# EasyEDA schematic blot-control-board.easyEDA-schematic.json
TITLE: Sheet_1; REV: 1.0; Date: 2024-05-08; Sheet: 1/1; Drawn By: bettermakestuff; Company: Your Company
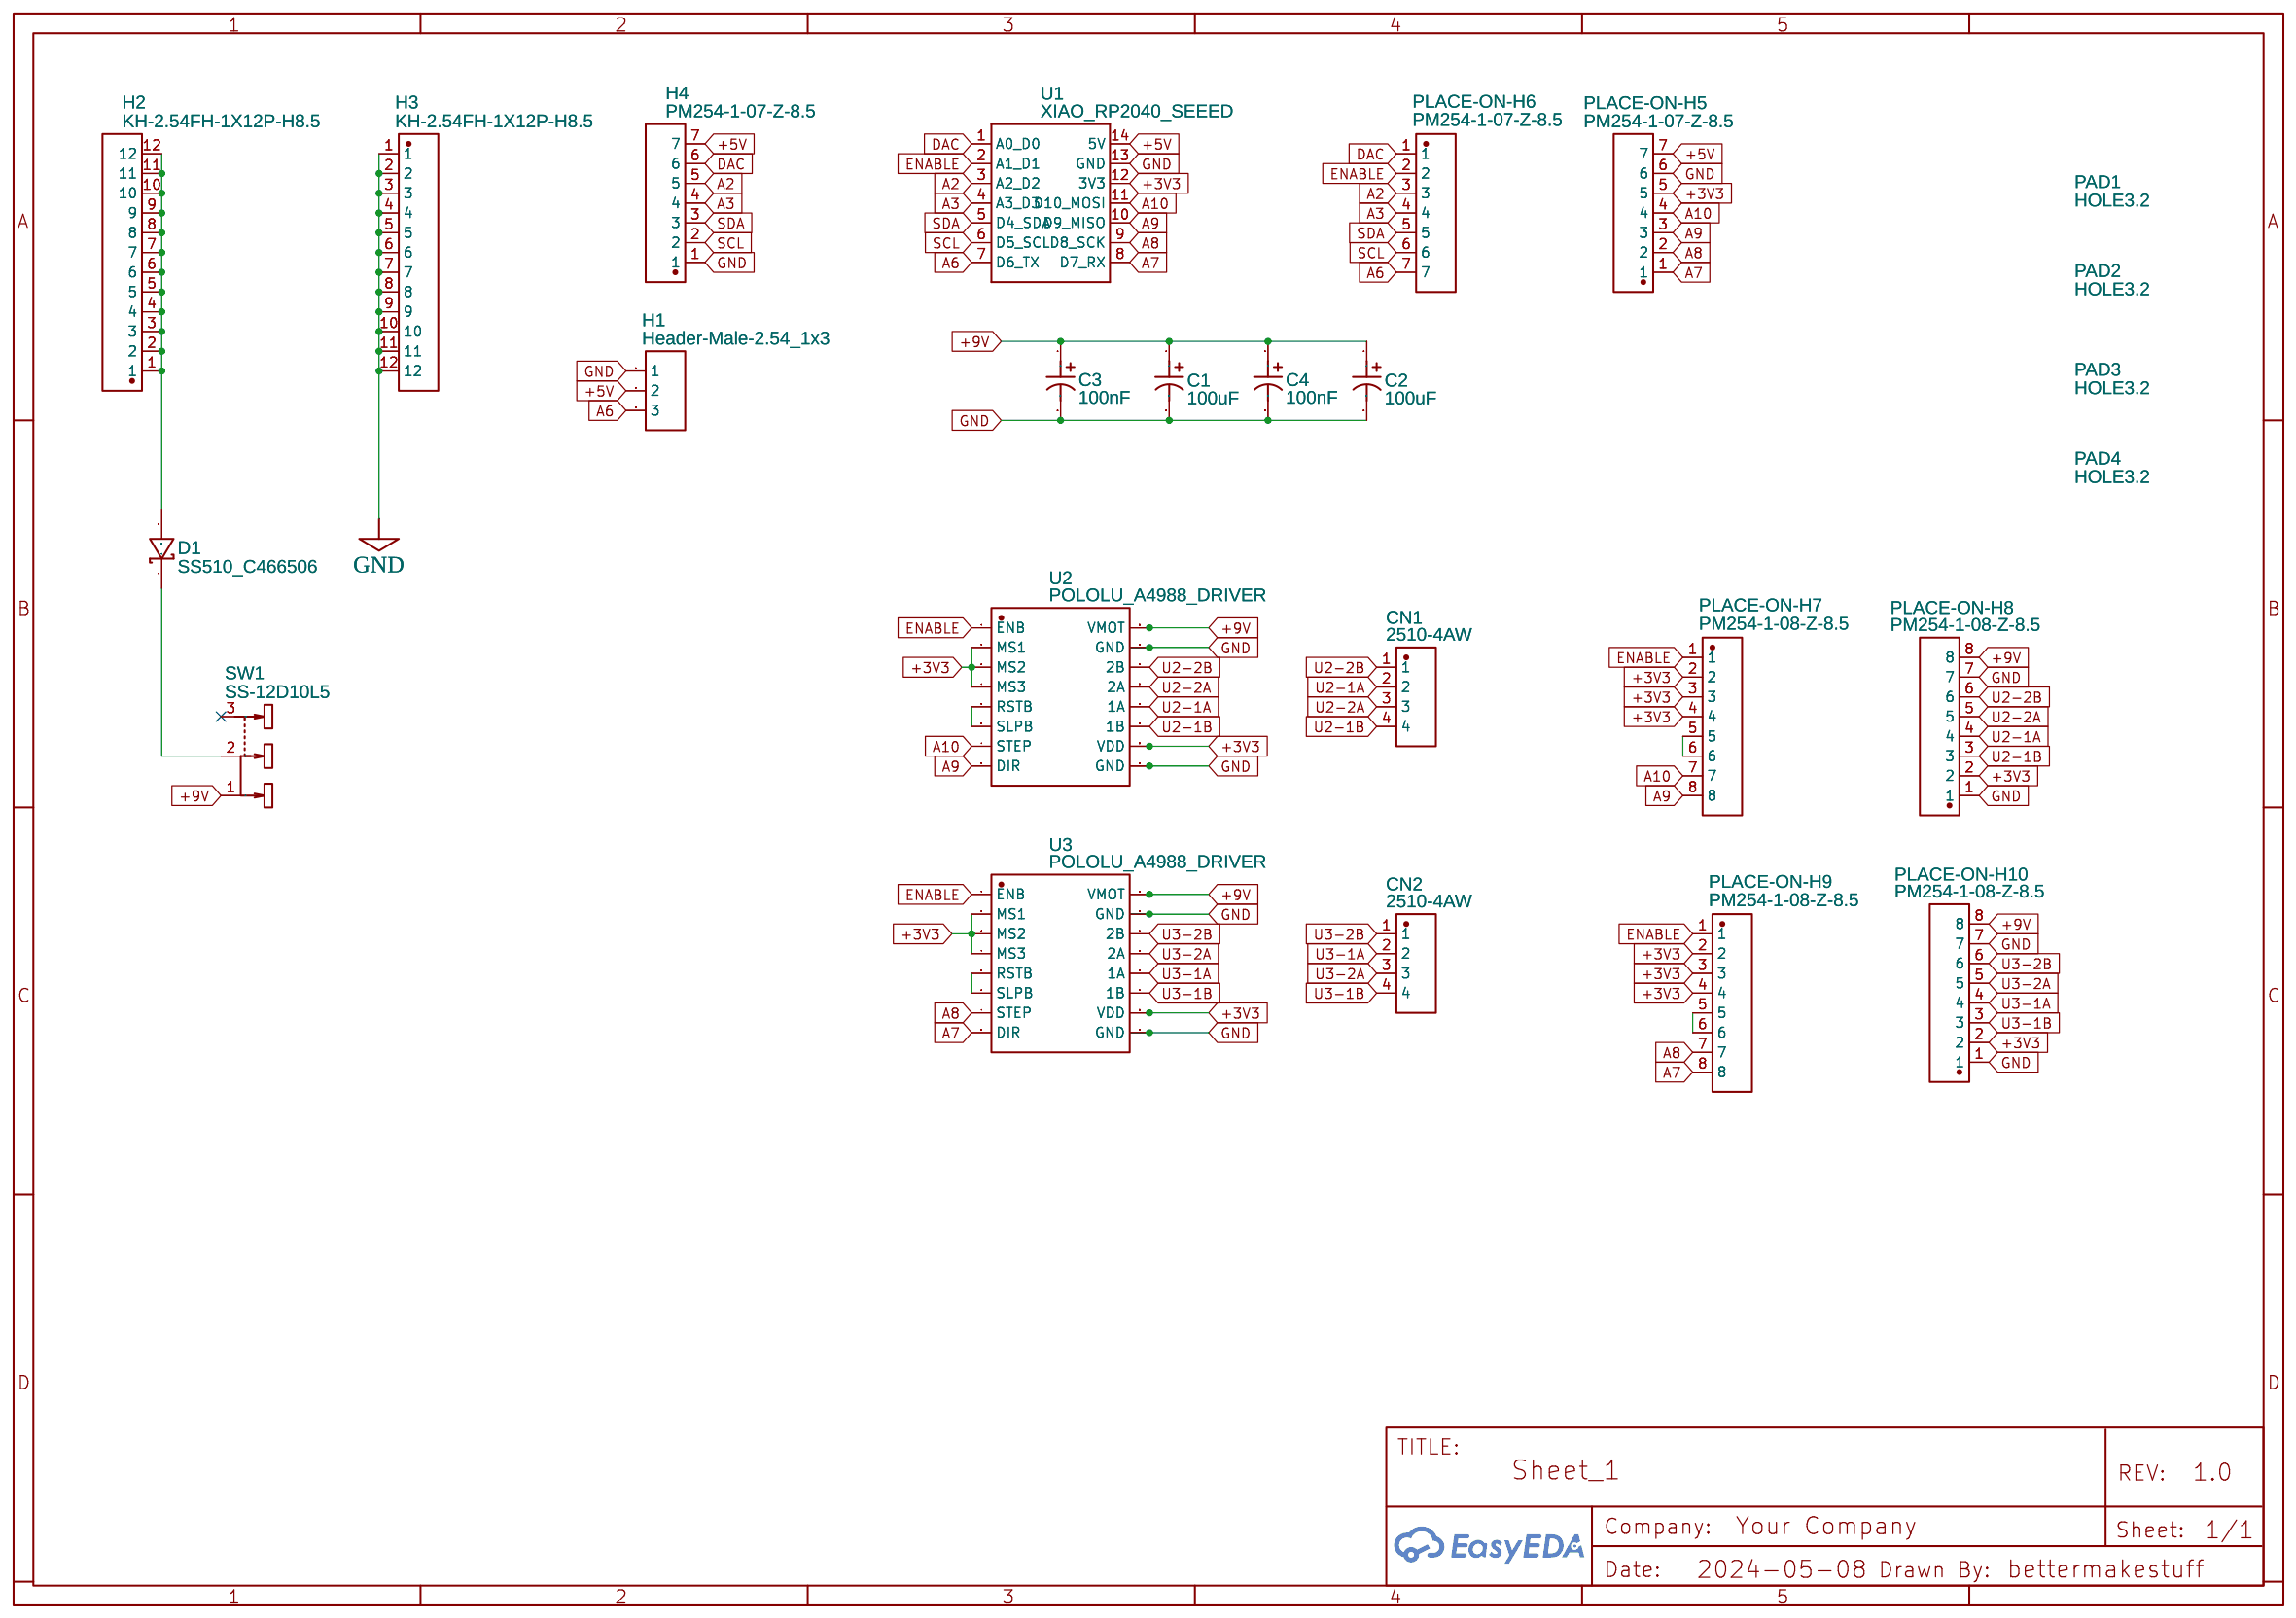
[diagram p0: schematic sheet]

## Parts
C1  100uF  [CAP-SMD_BD6.3-L6.6-W6.6-LS7.3-FD]
C2  100uF  [CAP-SMD_BD6.3-L6.6-W6.6-LS7.3-FD]
C3  100nF  [CAP-SMD_L3.2-W1.6-RD]
C4  100nF  [CAP-SMD_L3.2-W1.6-RD]
CN1  2510-4AW  [CONN-TH_2510-4AW]
CN2  2510-4AW  [CONN-TH_2510-4AW]
D1  SS510_C466506  [SMA_L4.2-W2.6-LS5.3-RD]
H1  Header-Male-2.54_1x3  [HDR-TH_3P-P2.54-V-M-1]
H2  KH-2.54FH-1X12P-H8.5  [HDR-TH_12P-P2.54-V-F]
H3  KH-2.54FH-1X12P-H8.5  [HDR-TH_12P-P2.54-V-F]
H4  PM254-1-07-Z-8.5  [HDR-TH_7P-P2.54-V-F]
PAD1  HOLE3.2  [HOLE-3.2MM]
PAD2  HOLE3.2  [HOLE-3.2MM]
PAD3  HOLE3.2  [HOLE-3.2MM]
PAD4  HOLE3.2  [HOLE-3.2MM]
PLACE-ON-H5  PM254-1-07-Z-8.5  [HDR-TH_7P-P2.54-V-F]
PLACE-ON-H6  PM254-1-07-Z-8.5  [HDR-TH_7P-P2.54-V-F]
PLACE-ON-H7  PM254-1-08-Z-8.5  [HDR-TH_8P-P2.54-V-F]
PLACE-ON-H8  PM254-1-08-Z-8.5  [HDR-TH_8P-P2.54-V-F]
PLACE-ON-H9  PM254-1-08-Z-8.5  [HDR-TH_8P-P2.54-V-F]
PLACE-ON-H10  PM254-1-08-Z-8.5  [HDR-TH_8P-P2.54-V-F]
SW1  SS-12D10L5  [SW-TH_SS-12D10L5]
U1  XIAO_RP2040_SEEED  [XIAO_RP2040_SEEED]
U2  POLOLU_A4988_DRIVER  [POLOLU_A4988]
U3  POLOLU_A4988_DRIVER  [POLOLU_A4988]

## Library data of the parts
C1 C2 = RST100UF25V004: Supplier: LCSC; Supplier Part: C4747964; Manufacturer: KNSCHA(科尼盛); JLCPCB Part Class: Extended Part; Contributor: lcsc
C3 C4 = CA45-A-35V-0.1UF-K: Contributor: LCSC; Supplier: LCSC; Supplier Part: C2976900; Manufacturer: CEC(振华新云); JLCPCB Part Class: Extended Part
CN1 CN2 = 2510-4AW: Contributor: LCSC; Supplier: LCSC; Supplier Part: C722720; Manufacturer: CAX(创都); JLCPCB Part Class: Extended Part
D1 = SS510_C466506: Contributor: LCSC; Supplier: LCSC; Supplier Part: C466506; Manufacturer: High Diode(海德); Manufacturer Part: SS510; JLCPCB Part Class: Extended Part
H1 = Header-Male-2.54_1x3: Supplier: LCSC; Manufacturer: BOOMELE(博穆精密); Manufacturer Part: 2.54-1*3P针; Supplier Part: C49257; JLCPCB Part Class: Extended Part
H2 H3 = KH-2.54FH-1X12P-H8.5: Contributor: LCSC; Supplier: LCSC; Supplier Part: C2905419; Manufacturer: kinghelm(金航标); JLCPCB Part Class: Extended Part
H4 PLACE-ON-H5 PLACE-ON-H6 = PM254-1-07-Z-8.5: Contributor: LCSC; Supplier: LCSC; Supplier Part: C2897370; Manufacturer: HCTL(华灿天禄); JLCPCB Part Class: Extended Part
PAD1-PAD4 = HOLE3.2: Contributor: M.khalilsaeid
PLACE-ON-H7 PLACE-ON-H9 PLACE-ON-H10 = PM254-1-08-Z-8.5: Contributor: LCSC; Supplier: LCSC; Supplier Part: C2897371; Manufacturer: HCTL(华灿天禄); JLCPCB Part Class: Extended Part
PLACE-ON-H8 = PM254-1-08-Z-8.5: Contributor: LCSC; Supplier: LCSC; Supplier Part: C2897371; Manufacturer: HCTL(华灿天禄); JLCPCB Part Class: Extended Part; Package Display: No
SW1 = SS-12D10L5: Contributor: LCSC; Supplier: LCSC; Supplier Part: C319012; Manufacturer: XKB Connectivity(中国星坤); JLCPCB Part Class: Extended Part
U1 = XIAO_RP2040_SEEED: Contributor: jeen
U2 U3 = POLOLU_A4988_DRIVER: link: https://www.pololu.com/product/1182; Contributor: rom_yaz

## Nets
+3V3: PLACE-ON-H5.5 PLACE-ON-H7.2 PLACE-ON-H7.3 PLACE-ON-H7.4 PLACE-ON-H8.2 PLACE-ON-H9.2 PLACE-ON-H9.3 PLACE-ON-H9.4 PLACE-ON-H10.2 U1.12(3V3) U2.2(MS1) U2.3(MS2) U2.4(MS3) U2.10(VDD) U3.2(MS1) U3.3(MS2) U3.4(MS3) U3.10(VDD)
+5V: H1.2 H4.7 PLACE-ON-H5.7 U1.14(5V)
+9V: C1.1 C2.1 C3.1 C4.1 PLACE-ON-H8.8 PLACE-ON-H10.8 SW1.1 U2.16(VMOT) U3.16(VMOT)
GND: C1.2 C2.2 C3.2 C4.2 H1.1 H3.1 H3.2 H3.3 H3.4 H3.5 H3.6 H3.7 H3.8 H3.9 H3.10 H3.11 H3.12 H4.1 PLACE-ON-H5.6 PLACE-ON-H8.1 PLACE-ON-H8.7 PLACE-ON-H10.1 PLACE-ON-H10.7 U1.13(GND) U2.9(GND) U2.15(GND) U3.9(GND) U3.15(GND)
A2: H4.5 PLACE-ON-H6.3 U1.3(A2_D2)
A3: H4.4 PLACE-ON-H6.4 U1.4(A3_D3)
A6: H1.3 PLACE-ON-H6.7 U1.7(D6_TX)
A7: PLACE-ON-H5.1 PLACE-ON-H9.8 U1.8(D7_RX) U3.8(DIR)
A8: PLACE-ON-H5.2 PLACE-ON-H9.7 U1.9(D8_SCK) U3.7(STEP)
A9: PLACE-ON-H5.3 PLACE-ON-H7.8 U1.10(D9_MISO) U2.8(DIR)
A10: PLACE-ON-H5.4 PLACE-ON-H7.7 U1.11(D10_MOSI) U2.7(STEP)
DAC: H4.6 PLACE-ON-H6.1 U1.1(A0_D0)
ENABLE: PLACE-ON-H6.2 PLACE-ON-H7.1 PLACE-ON-H9.1 U1.2(A1_D1) U2.1(ENB) U3.1(ENB)
SCL: H4.2 PLACE-ON-H6.6 U1.6(D5_SCL)
SDA: H4.3 PLACE-ON-H6.5 U1.5(D4_SDA)
U2-1A: CN1.2 PLACE-ON-H8.4 U2.12(1A)
U2-1B: CN1.4 PLACE-ON-H8.3 U2.11(1B)
U2-2A: CN1.3 PLACE-ON-H8.5 U2.13(2A)
U2-2B: CN1.1 PLACE-ON-H8.6 U2.14(2B)
U3-1A: CN2.2 PLACE-ON-H10.4 U3.12(1A)
U3-1B: CN2.4 PLACE-ON-H10.3 U3.11(1B)
U3-2A: CN2.3 PLACE-ON-H10.5 U3.13(2A)
U3-2B: CN2.1 PLACE-ON-H10.6 U3.14(2B)
Net-(D1-1): D1.1 SW1.2
Net-(D1-2): D1.2 H2.1 H2.2 H2.3 H2.4 H2.5 H2.6 H2.7 H2.8 H2.9 H2.10 H2.11 H2.12
Net-(PLACE-ON-H7-5): PLACE-ON-H7.5 PLACE-ON-H7.6
Net-(PLACE-ON-H9-5): PLACE-ON-H9.5 PLACE-ON-H9.6
Net-(U2-5): U2.5(RSTB) U2.6(SLPB)
Net-(U3-5): U3.5(RSTB) U3.6(SLPB)

Not connected (* = marked no-connect by the designer): SW1 3*
